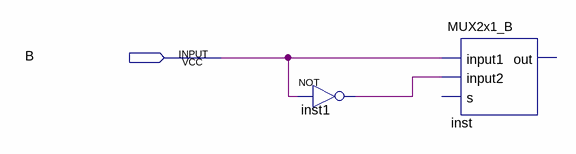
[diagram p0: schematic sheet]
// Quartus schematic block_MUX2x1_B.bdf as structural Verilog: 2 symbols, 1 pins
module block_MUX2x1_B (
  input  B
);

  wire inst1_out;

  not inst1 (inst1_out, B);
  MUX2x1_B inst (.input1(B), .input2(inst1_out));  // open: s, out
endmodule
